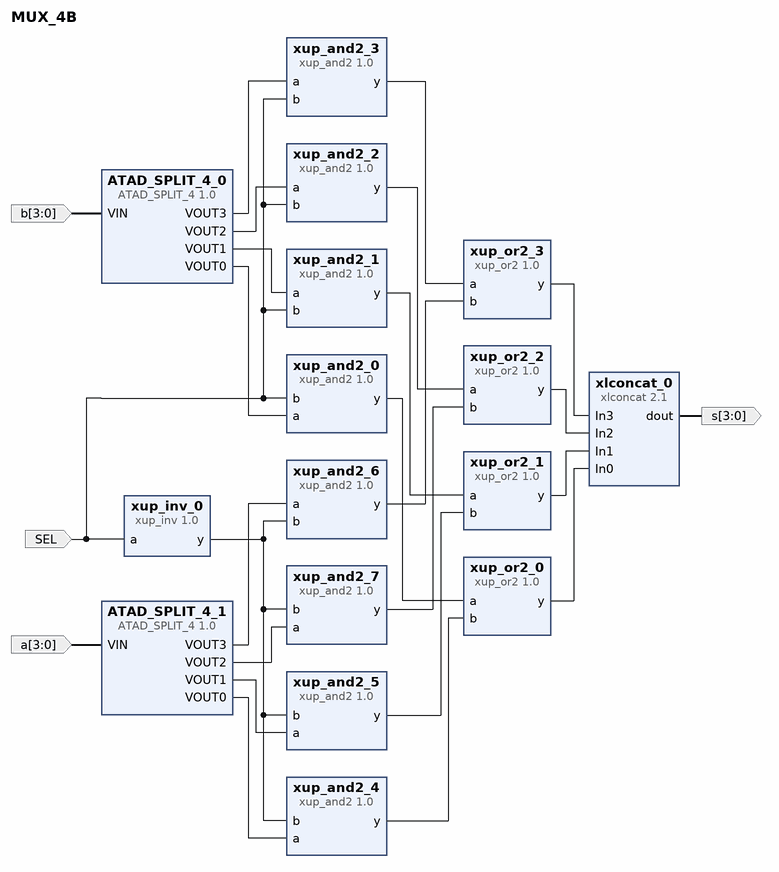
[diagram p0: block diagram of the top level]
# Vivado block design MUX_4B, xc7a100tcsg324-1, Vivado 2020.1
create_bd_design MUX_4B

create_bd_port -dir I SEL
create_bd_port -dir O -from 3 -to 0 s
create_bd_port -dir I -from 3 -to 0 a
create_bd_port -dir I -from 3 -to 0 b

create_bd_cell -type ip -vlnv xilinx.com:user:ATAD_SPLIT_4:1.0 ATAD_SPLIT_4_0
create_bd_cell -type ip -vlnv xilinx.com:user:ATAD_SPLIT_4:1.0 ATAD_SPLIT_4_1
create_bd_cell -type ip -vlnv xilinx.com:xup:xup_inv:1.0 xup_inv_0
create_bd_cell -type ip -vlnv xilinx.com:xup:xup_and2:1.0 xup_and2_0
create_bd_cell -type ip -vlnv xilinx.com:xup:xup_and2:1.0 xup_and2_1
create_bd_cell -type ip -vlnv xilinx.com:xup:xup_and2:1.0 xup_and2_2
create_bd_cell -type ip -vlnv xilinx.com:xup:xup_and2:1.0 xup_and2_3
create_bd_cell -type ip -vlnv xilinx.com:xup:xup_and2:1.0 xup_and2_4
create_bd_cell -type ip -vlnv xilinx.com:xup:xup_and2:1.0 xup_and2_5
create_bd_cell -type ip -vlnv xilinx.com:xup:xup_and2:1.0 xup_and2_6
create_bd_cell -type ip -vlnv xilinx.com:xup:xup_and2:1.0 xup_and2_7
create_bd_cell -type ip -vlnv xilinx.com:xup:xup_or2:1.0 xup_or2_0
create_bd_cell -type ip -vlnv xilinx.com:xup:xup_or2:1.0 xup_or2_1
create_bd_cell -type ip -vlnv xilinx.com:xup:xup_or2:1.0 xup_or2_2
create_bd_cell -type ip -vlnv xilinx.com:xup:xup_or2:1.0 xup_or2_3
create_bd_cell -type ip -vlnv xilinx.com:ip:xlconcat:2.1 xlconcat_0
set_property -dict {CONFIG.NUM_PORTS 4} [get_bd_cells xlconcat_0]

# ---- connections ----

connect_bd_net [get_bd_ports SEL] \
  [get_bd_pins xup_inv_0/a] [get_bd_pins xup_and2_3/b] [get_bd_pins xup_and2_2/b] [get_bd_pins xup_and2_1/b] \
  [get_bd_pins xup_and2_0/b]
connect_bd_net [get_bd_pins xup_inv_0/y] [get_bd_pins xup_and2_4/b] [get_bd_pins xup_and2_5/b] [get_bd_pins xup_and2_7/b] [get_bd_pins xup_and2_6/b]
connect_bd_net [get_bd_pins ATAD_SPLIT_4_1/VOUT0] [get_bd_pins xup_and2_4/a]
connect_bd_net [get_bd_pins ATAD_SPLIT_4_1/VOUT1] [get_bd_pins xup_and2_5/a]
connect_bd_net [get_bd_pins ATAD_SPLIT_4_1/VOUT2] [get_bd_pins xup_and2_7/a]
connect_bd_net [get_bd_pins ATAD_SPLIT_4_1/VOUT3] [get_bd_pins xup_and2_6/a]
connect_bd_net [get_bd_pins ATAD_SPLIT_4_0/VOUT0] [get_bd_pins xup_and2_0/a]
connect_bd_net [get_bd_pins ATAD_SPLIT_4_0/VOUT1] [get_bd_pins xup_and2_1/a]
connect_bd_net [get_bd_pins ATAD_SPLIT_4_0/VOUT2] [get_bd_pins xup_and2_2/a]
connect_bd_net [get_bd_pins ATAD_SPLIT_4_0/VOUT3] [get_bd_pins xup_and2_3/a]
connect_bd_net [get_bd_pins xup_and2_0/y] [get_bd_pins xup_or2_0/a]
connect_bd_net [get_bd_pins xup_and2_4/y] [get_bd_pins xup_or2_0/b]
connect_bd_net [get_bd_pins xup_and2_1/y] [get_bd_pins xup_or2_1/a]
connect_bd_net [get_bd_pins xup_and2_5/y] [get_bd_pins xup_or2_1/b]
connect_bd_net [get_bd_pins xup_and2_2/y] [get_bd_pins xup_or2_2/a]
connect_bd_net [get_bd_pins xup_and2_7/y] [get_bd_pins xup_or2_2/b]
connect_bd_net [get_bd_pins xup_and2_6/y] [get_bd_pins xup_or2_3/b]
connect_bd_net [get_bd_pins xup_and2_3/y] [get_bd_pins xup_or2_3/a]
connect_bd_net [get_bd_pins xup_or2_0/y] [get_bd_pins xlconcat_0/In0]
connect_bd_net [get_bd_pins xup_or2_1/y] [get_bd_pins xlconcat_0/In1]
connect_bd_net [get_bd_pins xup_or2_2/y] [get_bd_pins xlconcat_0/In2]
connect_bd_net [get_bd_pins xup_or2_3/y] [get_bd_pins xlconcat_0/In3]
connect_bd_net [get_bd_pins xlconcat_0/dout] [get_bd_ports s]
connect_bd_net [get_bd_ports a] [get_bd_pins ATAD_SPLIT_4_1/VIN]
connect_bd_net [get_bd_ports b] [get_bd_pins ATAD_SPLIT_4_0/VIN]

validate_bd_design
save_bd_design
